# EAGLE design B152X (EAGLE 6.6.0)
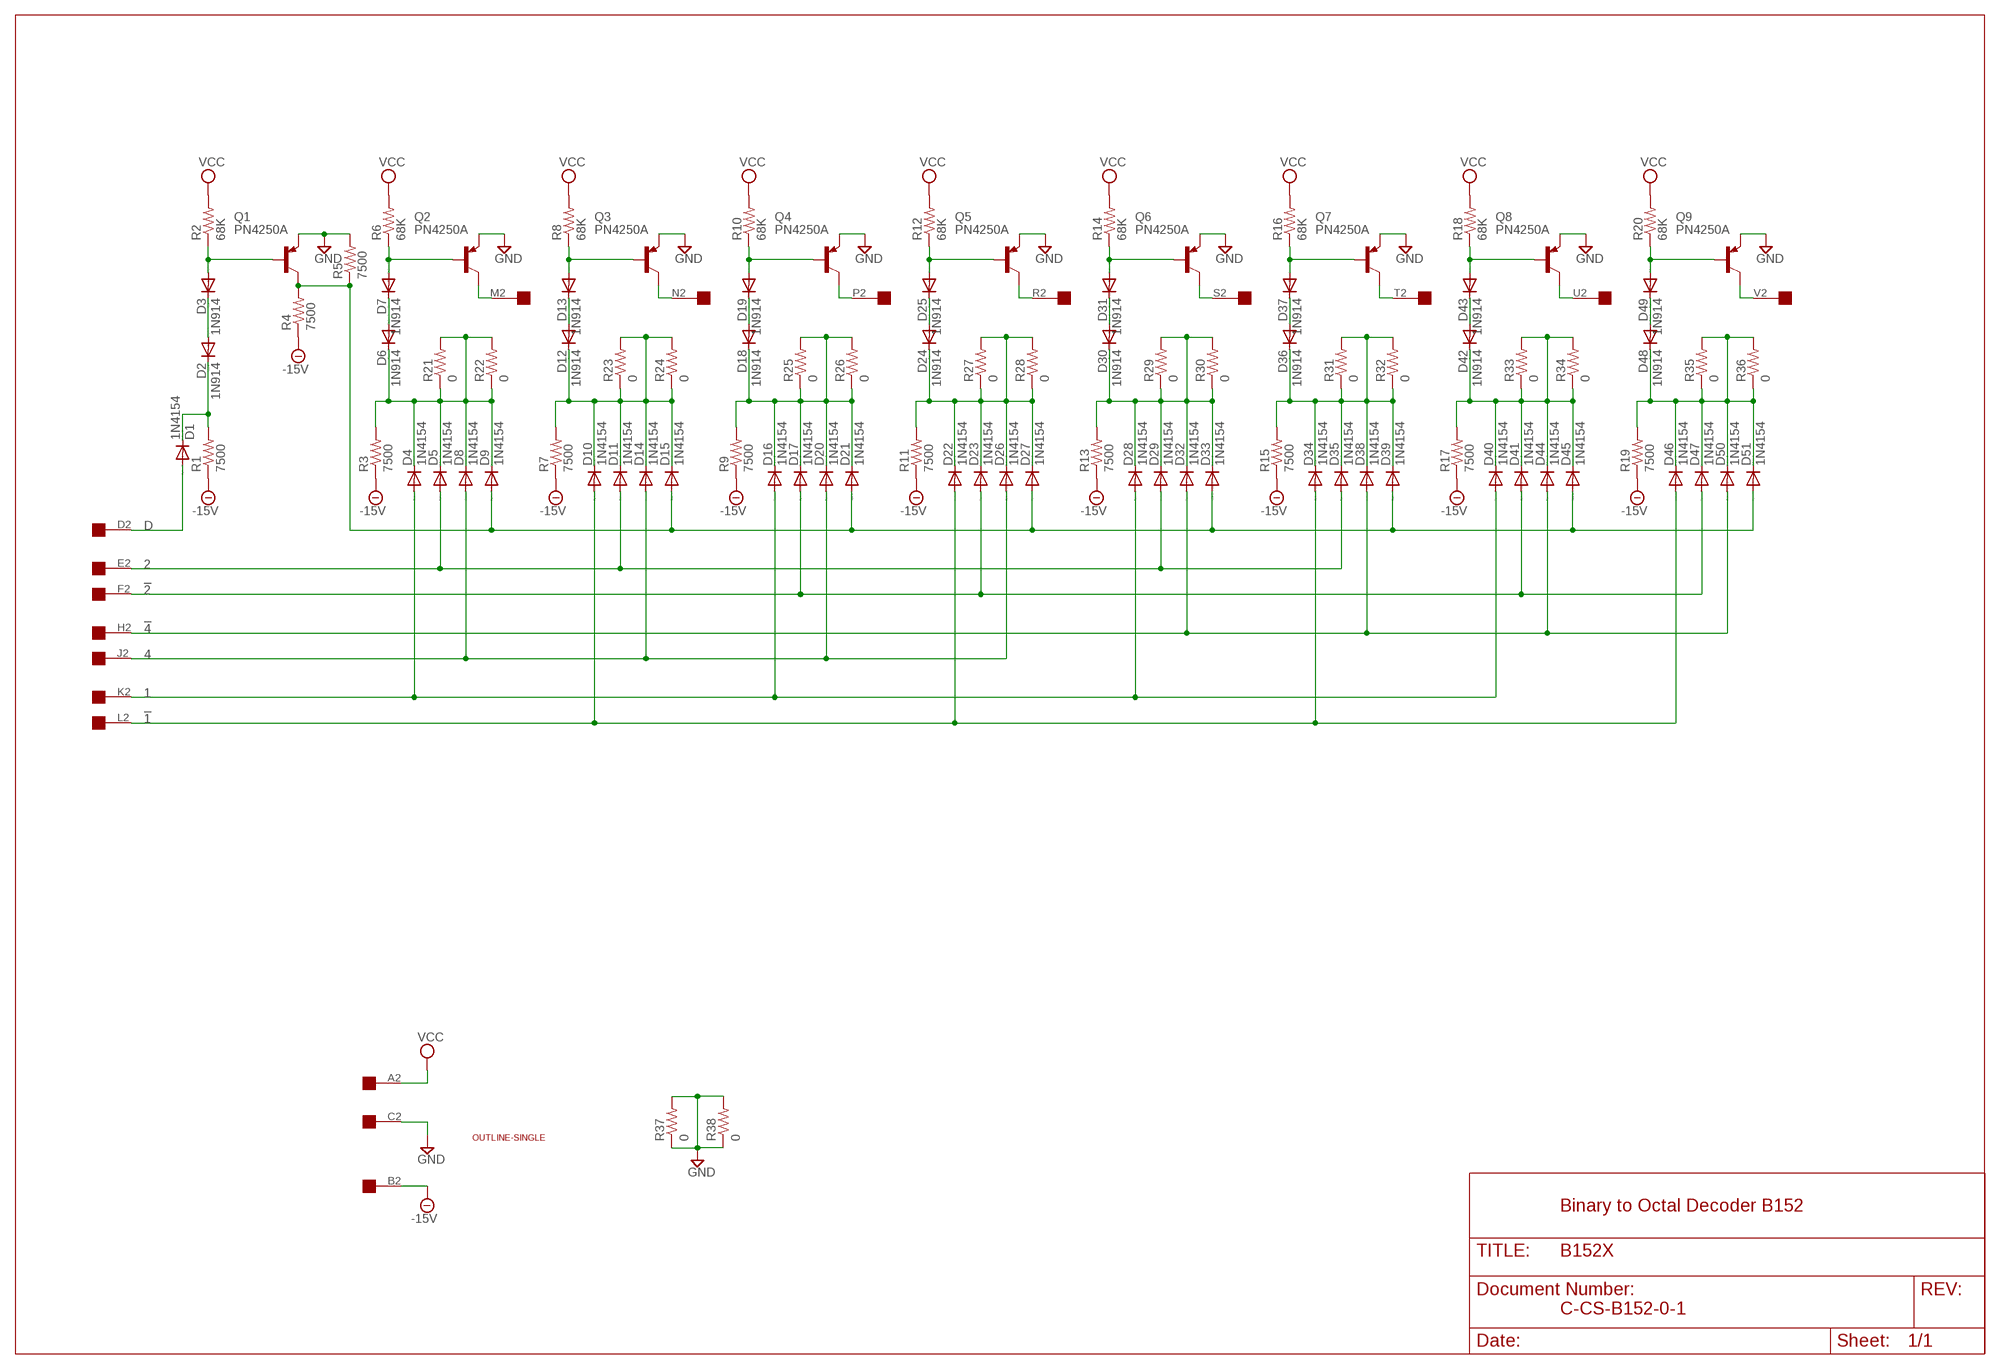
[diagram p0: schematic, sheet 1]

## Parts
D1  1N4154  DIODE-DO35-10  [DO35-10]
D2  1N914  DIODE-DO35-10  [DO35-10]
D3  1N914  DIODE-DO35-10  [DO35-10]
D4  1N4154  DIODE-DO35-10  [DO35-10]
D5  1N4154  DIODE-DO35-10  [DO35-10]
D6  1N914  DIODE-DO35-10  [DO35-10]
D7  1N914  DIODE-DO35-10  [DO35-10]
D8  1N4154  DIODE-DO35-10  [DO35-10]
D9  1N4154  DIODE-DO35-10  [DO35-10]
D10  1N4154  DIODE-DO35-10  [DO35-10]
D11  1N4154  DIODE-DO35-10  [DO35-10]
D12  1N914  DIODE-DO35-10  [DO35-10]
D13  1N914  DIODE-DO35-10  [DO35-10]
D14  1N4154  DIODE-DO35-10  [DO35-10]
D15  1N4154  DIODE-DO35-10  [DO35-10]
D16  1N4154  DIODE-DO35-10  [DO35-10]
D17  1N4154  DIODE-DO35-10  [DO35-10]
D18  1N914  DIODE-DO35-10  [DO35-10]
D19  1N914  DIODE-DO35-10  [DO35-10]
D20  1N4154  DIODE-DO35-10  [DO35-10]
D21  1N4154  DIODE-DO35-10  [DO35-10]
D22  1N4154  DIODE-DO35-10  [DO35-10]
D23  1N4154  DIODE-DO35-10  [DO35-10]
D24  1N914  DIODE-DO35-10  [DO35-10]
D25  1N914  DIODE-DO35-10  [DO35-10]
D26  1N4154  DIODE-DO35-10  [DO35-10]
D27  1N4154  DIODE-DO35-10  [DO35-10]
D28  1N4154  DIODE-DO35-10  [DO35-10]
D29  1N4154  DIODE-DO35-10  [DO35-10]
D30  1N914  DIODE-DO35-10  [DO35-10]
D31  1N914  DIODE-DO35-10  [DO35-10]
D32  1N4154  DIODE-DO35-10  [DO35-10]
D33  1N4154  DIODE-DO35-10  [DO35-10]
D34  1N4154  DIODE-DO35-10  [DO35-10]
D35  1N4154  DIODE-DO35-10  [DO35-10]
D36  1N914  DIODE-DO35-10  [DO35-10]
D37  1N914  DIODE-DO35-10  [DO35-10]
D38  1N4154  DIODE-DO35-10  [DO35-10]
D39  1N4154  DIODE-DO35-10  [DO35-10]
D40  1N4154  DIODE-DO35-10  [DO35-10]
D41  1N4154  DIODE-DO35-10  [DO35-10]
D42  1N914  DIODE-DO35-10  [DO35-10]
D43  1N914  DIODE-DO35-10  [DO35-10]
D44  1N4154  DIODE-DO35-10  [DO35-10]
D45  1N4154  DIODE-DO35-10  [DO35-10]
D46  1N4154  DIODE-DO35-10  [DO35-10]
D47  1N4154  DIODE-DO35-10  [DO35-10]
D48  1N914  DIODE-DO35-10  [DO35-10]
D49  1N914  DIODE-DO35-10  [DO35-10]
D50  1N4154  DIODE-DO35-10  [DO35-10]
D51  1N4154  DIODE-DO35-10  [DO35-10]
Q1  PN4250A  -PNP-TO5  [TO5]
Q2  PN4250A  -PNP-TO5  [TO5]
Q3  PN4250A  -PNP-TO5  [TO5]
Q4  PN4250A  -PNP-TO5  [TO5]
Q5  PN4250A  -PNP-TO5  [TO5]
Q6  PN4250A  -PNP-TO5  [TO5]
Q7  PN4250A  -PNP-TO5  [TO5]
Q8  PN4250A  -PNP-TO5  [TO5]
Q9  PN4250A  -PNP-TO5  [TO5]
R1  7500  R-US_0207/10  [0207/10]
R2  68K  R-US_0207/10  [0207/10]
R3  7500  R-US_0207/10  [0207/10]
R4  7500  R-US_0207/10  [0207/10]
R5  7500  R-US_0207/10  [0207/10]
R6  68K  R-US_0207/10  [0207/10]
R7  7500  R-US_0207/10  [0207/10]
R8  68K  R-US_0207/10  [0207/10]
R9  7500  R-US_0207/10  [0207/10]
R10  68K  R-US_0207/10  [0207/10]
R11  7500  R-US_0207/10  [0207/10]
R12  68K  R-US_0207/10  [0207/10]
R13  7500  R-US_0207/10  [0207/10]
R14  68K  R-US_0207/10  [0207/10]
R15  7500  R-US_0207/10  [0207/10]
R16  68K  R-US_0207/10  [0207/10]
R17  7500  R-US_0207/10  [0207/10]
R18  68K  R-US_0207/10  [0207/10]
R19  7500  R-US_0207/10  [0207/10]
R20  68K  R-US_0207/10  [0207/10]
R21  0  R-US_0207/10  [0207/10]
R22  0  R-US_0207/10  [0207/10]
R23  0  R-US_0207/10  [0207/10]
R24  0  R-US_0207/10  [0207/10]
R25  0  R-US_0207/10  [0207/10]
R26  0  R-US_0207/10  [0207/10]
R27  0  R-US_0207/10  [0207/10]
R28  0  R-US_0207/10  [0207/10]
R29  0  R-US_0207/10  [0207/10]
R30  0  R-US_0207/10  [0207/10]
R31  0  R-US_0207/10  [0207/10]
R32  0  R-US_0207/10  [0207/10]
R33  0  R-US_0207/10  [0207/10]
R34  0  R-US_0207/10  [0207/10]
R35  0  R-US_0207/10  [0207/10]
R36  0  R-US_0207/10  [0207/10]
R37  0  R-US_0207/10  [0207/10]
R38  0  R-US_0207/10  [0207/10]
U$1  OUTLINE-SINGLE  [SINGLE]
U$2  EDGE-1  [EDGE-CON1]

## Nets
1: D4.A D16.A D28.A D40.A U$2.K2
2: D5.A D11.A D29.A D35.A U$2.E2
4: D8.A D14.A D20.A D26.A U$2.J2
!1: D10.A D22.A D34.A D46.A U$2.L2
!2: D17.A D23.A D41.A D47.A U$2.F2
!4: D32.A D38.A D44.A D50.A U$2.H2
-15V: R1.1 R3.1 R4.1 R7.1 R9.1 R11.1 R13.1 R15.1 R17.1 R19.1 U$2.B2
D: D1.A U$2.D2
GND: Q1.1(E) Q2.1(E) Q3.1(E) Q4.1(E) Q5.1(E) Q6.1(E) Q7.1(E) Q8.1(E) Q9.1(E) R5.2 R37.1 R37.2 R38.1 R38.2 U$2.C2
N$1: D3.A Q1.2(B) R2.1
N$2: D2.A D3.C
N$3: D1.C D2.C R1.2
N$4: D9.A D15.A D21.A D27.A D33.A D39.A D45.A D51.A Q1.3(C) R4.2 R5.1
N$5: D28.C D29.C D30.C D32.C D33.C R13.2 R29.1 R29.2 R30.1 R30.2
N$6: D34.C D35.C D36.C D38.C D39.C R15.2 R31.1 R31.2 R32.1 R32.2
N$7: D40.C D41.C D42.C D44.C D45.C R17.2 R33.1 R33.2 R34.1 R34.2
N$8: D46.C D47.C D48.C D50.C D51.C R19.2 R35.1 R35.2 R36.1 R36.2
N$9: D4.C D5.C D6.C D8.C D9.C R3.2 R21.1 R21.2 R22.1 R22.2
N$10: D10.C D11.C D12.C D14.C D15.C R7.2 R23.1 R23.2 R24.1 R24.2
N$12: D6.A D7.C
N$13: D7.A Q2.2(B) R6.1
N$14: Q2.3(C) U$2.M2
N$15: D16.C D17.C D18.C D20.C D21.C R9.2 R25.1 R25.2 R26.1 R26.2
N$17: D12.A D13.C
N$18: D13.A Q3.2(B) R8.1
N$19: Q3.3(C) U$2.N2
N$20: D22.C D23.C D24.C D26.C D27.C R11.2 R27.1 R27.2 R28.1 R28.2
N$22: D18.A D19.C
N$23: D19.A Q4.2(B) R10.1
N$24: Q4.3(C) U$2.P2
N$27: D24.A D25.C
N$28: D25.A Q5.2(B) R12.1
N$29: Q5.3(C) U$2.R2
N$32: D30.A D31.C
N$33: D31.A Q6.2(B) R14.1
N$34: Q6.3(C) U$2.S2
N$37: D36.A D37.C
N$38: D37.A Q7.2(B) R16.1
N$39: Q7.3(C) U$2.T2
N$42: D42.A D43.C
N$43: D43.A Q8.2(B) R18.1
N$44: Q8.3(C) U$2.U2
N$47: D48.A D49.C
N$48: D49.A Q9.2(B) R20.1
N$49: Q9.3(C) U$2.V2
VCC: R2.2 R6.2 R8.2 R10.2 R12.2 R14.2 R16.2 R18.2 R20.2 U$2.A2

## Notes on the sheet
- Binary to Octal Decoder B152
- C-CS-B152-0-1

## Library data of the parts
D1-D51 = diode:DIODE-: DIODE
Q1-Q9 = transistor:*-PNP-: PNP Transistror
R1-R38 = rcl:R-US_: RESISTOR, American symbol
U$1 = dec-con:OUTLINE-*: Board outlines for DEC boards.
U$2 = dec-con:EDGE-1: Single-Sided DEC Edge Connector -- (side 2)

## Board
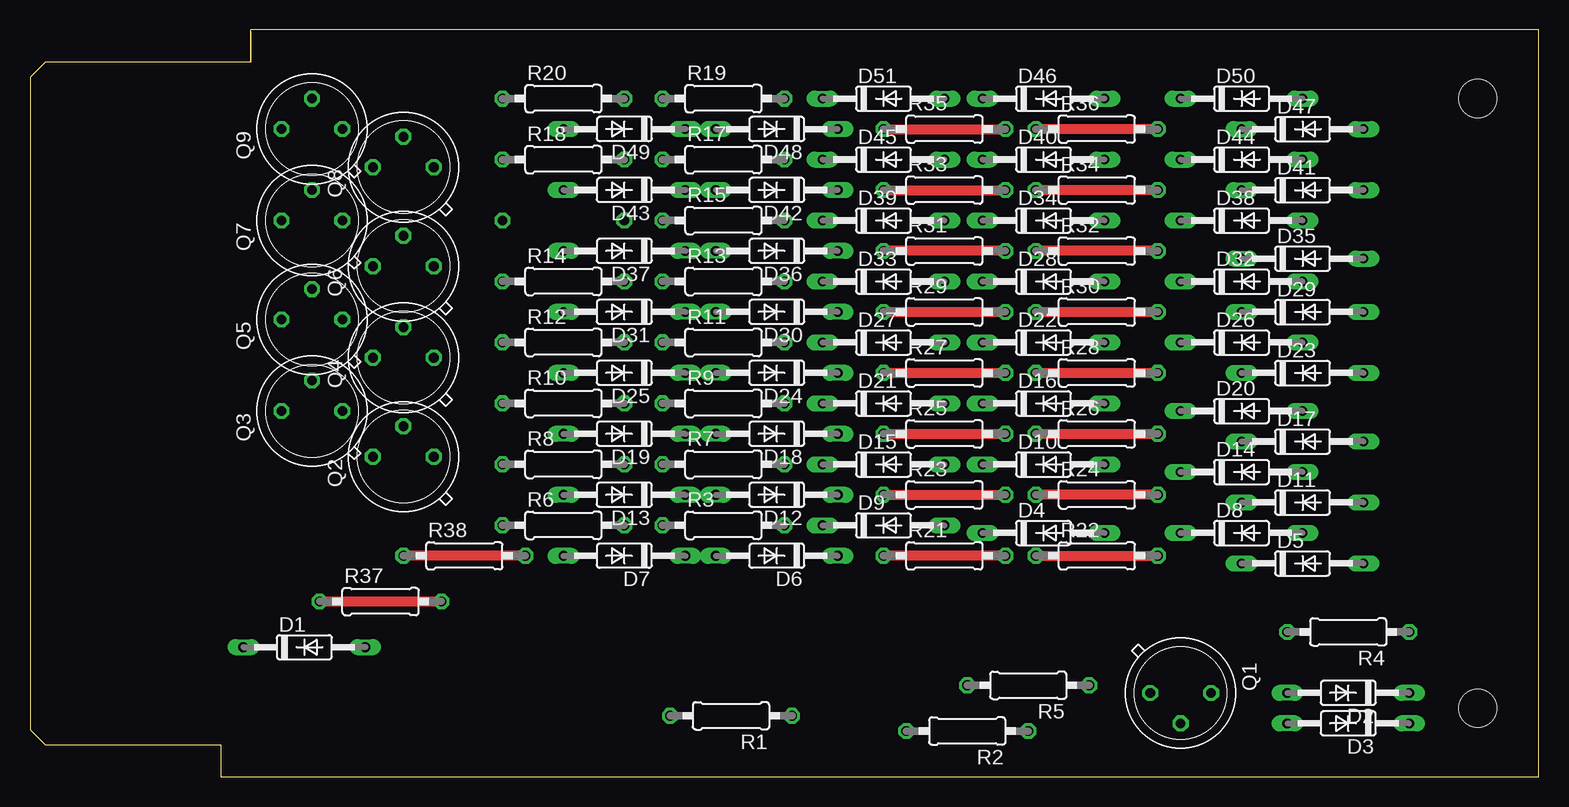
[diagram p1: board, top side]
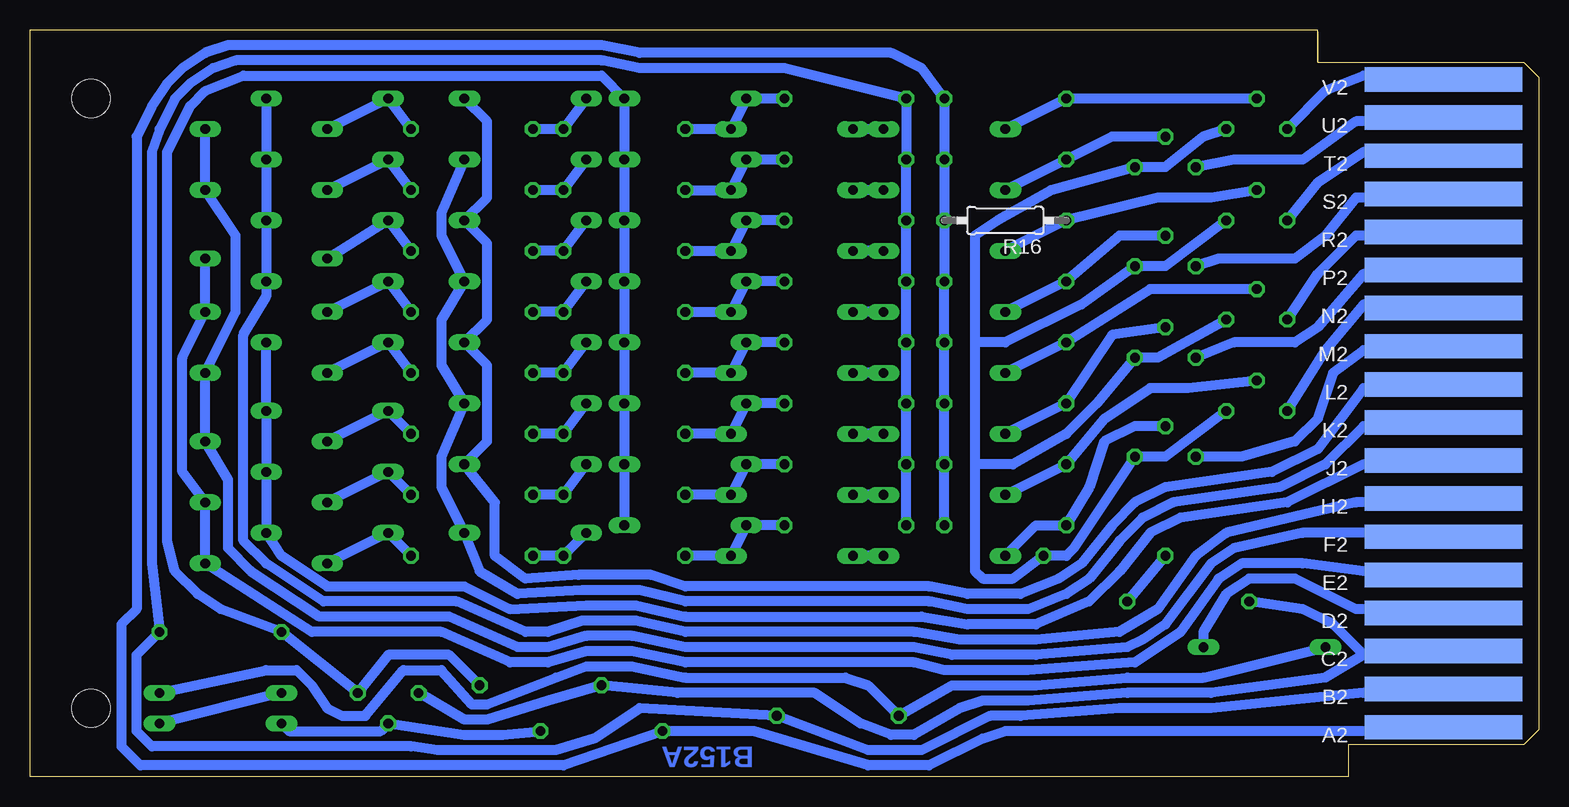
[diagram p2: board, bottom side, seen from below]

Size 125.73 x 62.23 mm. Coordinates in mm from the lower left corner, seen from the top.
Copper layers (1+16): Top 0.035mm / dielectric 1.5mm / Bottom 0.035mm
Design rules "16mils": minimum track width 16mil, minimum drill 32mil, track to track 15mil, track to pad 10mil, pad to pad 10mil, via to via 10mil, smd to smd 10mil, copper to edge 13mil, drill to drill 10mil, minimum pad ring 10mil, minimum via ring 8mil, stop-mask expansion 0mil, vias tented up to drill 0mil, thermal gap 10mil

### Footprints (pad centres in the part's own frame; a part is rotated, then mirrored left to right if it is on the bottom)
DO35-10 = drill 0.813 long: A 5.08,0; C -5.08,0
TO5 = drill 0.813 octagon: 1 0,-2.54; 2 2.54,0; 3 0,2.54
0207/10 = drill 0.813 octagon: 1 -5.08,0; 2 5.08,0
SINGLE = hole 3.175: 120.65,56.515; 120.65,5.715
EDGE-CON1 = smd 13.106 x 2.032 bottom: A2 7.938,4.128; B2 7.938,7.303; C2 7.938,10.477; D2 7.938,13.652; E2 7.938,16.828; F2 7.938,20.003; H2 7.938,23.177; J2 7.938,26.352; K2 7.938,29.527; L2 7.938,32.703; M2 7.938,35.877; N2 7.938,39.053; P2 7.938,42.227; R2 7.938,45.403; S2 7.938,48.578; T2 7.938,51.752; U2 7.938,54.928; V2 7.938,58.102

### Placement (x,y rotation side)
D1  22.86,10.79 0 top
D2  109.86,6.99 180 top
D3  109.86,4.45 180 top
D4  84.46,20.32 0 top
D5  106.05,17.78 0 top
D6  62.23,18.41 180 top
D7  49.53,18.41 180 top
D8  100.97,20.32 0 top
D9  71.12,20.95 0 top
D10  84.46,26.04 0 top
D11  106.05,22.86 0 top
D12  62.23,23.5 180 top
D13  49.53,23.5 180 top
D14  100.97,25.4 0 top
D15  71.12,26.04 0 top
D16  84.46,31.11 0 top
D17  106.05,27.94 0 top
D18  62.23,28.57 180 top
D19  49.53,28.57 180 top
D20  100.97,30.48 0 top
D21  71.12,31.11 0 top
D22  84.46,36.2 0 top
D23  106.05,33.66 0 top
D24  62.23,33.66 180 top
D25  49.53,33.66 180 top
D26  100.97,36.2 0 top
D27  71.12,36.2 0 top
D28  84.46,41.27 0 top
D29  106.05,38.73 0 top
D30  62.23,38.73 180 top
D31  49.53,38.73 180 top
D32  100.97,41.27 0 top
D33  71.12,41.27 0 top
D34  84.46,46.35 0 top
D35  106.05,43.18 0 top
D36  62.23,43.81 180 top
D37  49.53,43.81 180 top
D38  100.97,46.35 0 top
D39  71.12,46.35 0 top
D40  84.46,51.44 0 top
D41  106.05,48.9 0 top
D42  62.23,48.9 180 top
D43  49.53,48.9 180 top
D44  100.97,51.44 0 top
D45  71.12,51.44 0 top
D46  84.46,56.52 0 top
D47  106.05,53.98 0 top
D48  62.23,53.98 180 top
D49  49.53,53.98 180 top
D50  100.97,56.52 0 top
D51  71.12,56.52 0 top
Q1  95.89,6.99 270 top
Q2  31.12,26.67 90 top
Q3  23.5,30.48 90 top
Q4  31.12,34.92 90 top
Q5  23.5,38.1 90 top
Q6  31.12,42.55 90 top
Q7  23.5,46.35 90 top
Q8  31.12,50.8 90 top
Q9  23.5,53.98 90 top
R1  58.42,5.08 180 top
R2  78.11,3.81 180 top
R3  57.79,20.95 0 top
R4  109.86,12.06 180 top
R5  83.19,7.62 180 top
R6  44.45,20.95 0 top
R7  57.79,26.04 0 top
R8  44.45,26.04 0 top
R9  57.79,31.11 0 top
R10  44.45,31.11 0 top
R11  57.79,36.2 0 top
R12  44.45,36.2 0 top
R13  57.79,41.27 0 top
R14  44.45,41.27 0 top
R15  57.79,46.35 0 top
R16  44.45,46.35 180 bottom
R17  57.79,51.44 0 top
R18  44.45,51.44 0 top
R19  57.79,56.52 0 top
R20  44.45,56.52 0 top
R21  76.2,18.41 0 top
R22  88.9,18.41 0 top
R23  76.2,23.5 0 top
R24  88.9,23.5 0 top
R25  76.2,28.57 0 top
R26  88.9,28.57 0 top
R27  76.2,33.66 0 top
R28  88.9,33.66 0 top
R29  76.2,38.73 0 top
R30  88.9,38.73 0 top
R31  76.2,43.81 0 top
R32  88.9,43.81 0 top
R33  76.2,48.9 0 top
R34  88.9,48.9 0 top
R35  76.2,53.98 0 top
R36  88.9,53.98 0 top
R37  29.21,14.61 0 top
R38  36.2,18.41 0 top
U$1  0,0 0 top
U$2  0,0 0 top

### Tracks (layer width: path | path; a pad name or v marks a point on that pad's centre or on a via)
1
  Bottom 0.813: U$2.K2 8.89,29.21 14.61,29.21 17.78,26.04 21.59,24.13 30.48,22.86 33.02,21.59 34.93,19.68 37.47,16.51 39.37,15.24 42.55,13.97 47.63,13.97 50.8,14.61 71.12,14.61 74.93,15.56 79.69,15.56 85.09,15.24 88.27,17.14 D4.A 91.44,24.13 91.44,26.67 D16.A 91.44,34.29 91.44,38.1 D28.A 91.44,45.09 91.44,46.99 D40.A
2
  Bottom 0.813: U$2.E2 8.89,17.14 14.61,17.14 19.69,17.78 24.77,17.78 26.67,16.51 29.85,12.06 33.66,9.53 42.55,8.89 49.53,8.89 52.07,9.53 71.12,9.53 75.57,10.48 79.38,10.48 82.55,9.53 85.73,9.53 91.44,12.06 102.24,12.06 D5.A D11.A 113.03,25.4 113.03,34.92 D29.A D35.A
4
  Bottom 0.813: U$2.J2 8.89,26.04 14.61,26.04 20.96,22.86 29.85,21.59 32.39,20.32 34.93,17.14 37.47,14.61 41.91,12.7 47.63,12.7 51.44,13.34 71.12,13.34 75.25,14.29 79.38,14.29 85.73,13.97 89.54,15.88 100.97,15.88 104.78,18.41 D8.A D14.A D20.A D26.A
!1
  Bottom 0.813: U$2.L2 8.89,32.38 14.61,32.38 18.42,27.3 22.23,25.4 31.12,24.13 33.66,22.86 35.56,20.95 38.1,17.78 40.01,16.51 43.18,15.24 47.63,15.24 50.8,15.88 71.12,15.88 73.98,16.83 80.01,16.83 84.46,16.51 87,18.41 87,22.86 D10.A 87.63,27.94 87.63,34.29 D22.A 87.63,38.1 87.63,44.45 D34.A 87.63,48.26 87.63,54.61 D46.A
!2
  Bottom 0.813: U$2.F2 8.89,20.32 19.69,20.32 25.4,19.05 27.31,17.78 31.12,12.7 33.02,11.43 34.29,10.79 41.91,10.16 48.9,10.16 52.07,10.79 71.12,10.79 75.57,11.75 79.38,11.75 82.55,10.79 85.09,10.79 90.81,13.34 101.6,13.34 107.32,17.14 109.22,19.05 109.22,24.77 D17.A D23.A 108.59,38.73 108.59,45.09 D41.A D47.A
!4
  Bottom 0.813: U$2.H2 8.89,22.86 15.24,22.86 26.04,20.32 28.58,18.41 31.75,13.97 34.93,12.06 41.91,11.43 48.26,11.43 52.07,12.06 71.12,12.06 75.25,13.02 79.69,13.02 82.55,12.06 84.46,12.06 90.17,14.61 101.28,14.61 106.05,17.78 107.95,19.68 107.95,36.83 106.05,40.01 D32.A D38.A D44.A D50.A
-15V
  Bottom 0.813: U$2.B2 9.53,6.99 14.61,6.99 27.31,5.71 34.93,5.71 43.18,5.08 45.72,5.08 51.44,2.22 55.88,2.22 R1.1 74.93,5.71 78.74,3.17 81.92,2.22 91.76,2.22 93.98,2.54 115.57,2.54 116.84,3.81 116.84,10.16 R4.1 115.57,17.78 115.57,52.07 114.94,53.98 113.67,56.52 112.4,57.78 110.49,59.05 108.59,59.69 78.11,59.69 74.93,59.05 62.87,59.05 R19.1 R17.1 R15.1 R13.1 R11.1 R9.1 R7.1 R3.1
D
  Bottom 0.813: U$2.D2 8.89,13.97 15.24,13.97 20.32,16.51 24.13,16.51 26.04,15.24 27.94,12.06 D1.A
GND
  Top 0.813: R37.1 R37.2 | R38.2 R38.1
  Bottom 0.813: U$2.C2 8.26,10.48 8.26,10.16 14.61,10.16 | 14.61,10.16 17.78,8.26 27.31,6.99 34.29,6.99 42.55,6.35 46.36,6.35 48.26,5.71 52.07,3.49 53.98,3.49 56.52,4.45 60.33,6.99 71.76,6.99 R5.2 82.55,6.35 87.63,4.76 89.54,4.76 Q1.1 | 14.61,10.16 17.15,12.7 19.69,13.97 R37.1 | R38.1 R37.2 | 46.99,26.04 43.82,26.04 39.37,28.57 36.83,31.11 Q4.1 31.75,34.92 Q5.1 | 46.99,26.04 46.99,17.14 46.36,16.51 43.82,16.51 R38.2 39.37,18.41 38.74,19.05 Q2.1 31.12,26.67 Q3.1 | 46.99,36.2 44.45,36.2 38.1,39.37 Q6.1 31.12,42.55 Q7.1 | 46.99,36.2 46.99,26.04 | Q9.1 27.94,53.34 31.12,50.8 Q8.1 40.64,48.9 45.09,46.35 46.99,45.09 46.99,36.2
N$1
  Bottom 0.813: D3.A 104.14,3.81 96.52,3.81 Q1.2 89.54,3.49 86.36,3.49 R2.1
N$2
  Bottom 0.813: D2.A D3.C
N$3
  Bottom 0.813: D2.C 106.05,8.89 103.51,8.89 102.24,7.62 100.97,5.71 99.7,5.08 97.79,5.08 94.62,8.89 91.44,8.89 88.9,6.03 87.63,6.03 81.92,8.26 79.38,9.21 75.57,9.21 71.12,8.26 57.79,8.26 55.88,7.62 R1.2 48.9,7.62 41.91,7.62 34.29,8.26 27.94,8.26 D1.C
N$4
  Bottom 0.813: D9.A D15.A D21.A D27.A D33.A D39.A D45.A D51.A 78.11,58.42 107.95,58.42 111.13,57.15 112.4,55.88 114.3,52.07 114.3,19.68 113.67,17.14 111.76,15.24 109.86,13.97 R4.2 Q1.3 95.89,10.16 90.81,10.16 R5.1
N$5
  Top 0.813: R29.1 R29.2 | R30.1 R30.2
  Bottom 0.813: R30.1 R29.2 D28.C | R13.2 D33.C D30.C R29.1 | R30.2 D32.C D29.C
N$6
  Top 0.813: R32.2 R32.1 | R31.2 R31.1
  Bottom 0.813: R32.1 R31.2 D34.C | R15.2 D39.C D36.C R31.1 | R32.2 D38.C D35.C
N$7
  Top 0.813: R33.1 R33.2 | R34.2 R34.1
  Bottom 0.813: R34.1 R33.2 D40.C | R34.2 D44.C D41.C | R17.2 D45.C D42.C R33.1
N$8
  Top 0.813: R35.1 R35.2 | R36.2 R36.1
  Bottom 0.813: R36.1 R35.2 D46.C | R36.2 D50.C D47.C | R19.2 D51.C D48.C R35.1
N$9
  Top 0.813: R21.2 R21.1 | R22.1 R22.2
  Bottom 0.813: R22.1 R21.2 D4.C | R22.2 D8.C D5.C | R21.1 D6.C D9.C R3.2
N$10
  Top 0.813: R24.2 R24.1 | R23.1 R23.2
  Bottom 0.813: R24.1 R23.2 D10.C | R24.2 D14.C D11.C | R23.1 D12.C D15.C R7.2
N$12
  Bottom 0.813: D7.C D6.A
N$13
  Bottom 0.813: Q2.2 33.66,29.21 36.2,27.94 37.47,24.13 R6.1 41.91,20.95 D7.A
N$14
  Bottom 0.813: U$2.M2 8.89,35.56 14.61,35.56 17.15,33.66 18.42,29.84 20.32,27.94 24.77,26.67 Q2.3
N$15
  Top 0.813: R25.1 R25.2 | R26.1 R26.2
  Bottom 0.813: R26.1 R25.2 D16.C | R26.2 D20.C D17.C | R25.1 D18.C D21.C R9.2
N$17
  Bottom 0.813: D13.C D12.A
N$18
  Bottom 0.813: Q3.2 29.21,32.38 32.39,32.38 36.2,29.84 R8.1 D13.A
N$19
  Bottom 0.813: U$2.N2 8.89,39.37 14.61,39.37 17.78,35.56 Q3.3
N$20
  Top 0.813: R27.1 R27.2 | R28.1 R28.2
  Bottom 0.813: R28.1 R27.2 D22.C | R28.2 D26.C D23.C | R27.1 D24.C D27.C R11.2
N$22
  Bottom 0.813: D19.C D18.A
N$23
  Bottom 0.813: Q4.2 35.56,36.83 R10.1 D19.A
N$24
  Bottom 0.813: U$2.P2 8.89,41.91 14.61,41.91 18.42,37.47 20.32,36.2 25.4,36.2 Q4.3
N$27
  Bottom 0.813: D25.C D24.A
N$28
  Bottom 0.813: Q5.2 32.39,40.64 R12.1 D25.A
N$29
  Bottom 0.813: U$2.R2 8.26,45.09 15.24,45.09 18.42,41.91 Q5.3
N$32
  Bottom 0.813: D31.C D30.A
N$33
  Bottom 0.813: Q6.2 34.93,45.09 R14.1 D31.A
N$34
  Bottom 0.813: U$2.S2 8.89,48.26 15.24,48.26 17.78,45.09 20.32,43.18 26.67,43.18 Q6.3
N$37
  Bottom 0.813: D37.C D36.A
N$38
  Bottom 0.813: Q7.2 27.31,48.26 31.75,48.26 R16.1 D37.A
N$39
  Bottom 0.813: U$2.T2 8.89,52.07 14.61,52.07 18.42,49.53 Q7.3
N$42
  Bottom 0.813: D43.C D42.A
N$43
  Bottom 0.813: Q8.2 35.56,53.34 R18.1 D43.A
N$44
  Bottom 0.813: U$2.U2 8.89,54.61 15.24,54.61 19.69,51.44 25.4,51.44 Q8.3
N$47
  Bottom 0.813: D49.C D48.A
N$48
  Bottom 0.813: Q9.2 R20.1 D49.A
N$49
  Bottom 0.813: U$2.V2 8.89,58.42 14.61,58.42 17.78,57.15 Q9.3
VCC
  Bottom 0.813: U$2.A2 8.89,3.81 44.45,3.81 46.36,3.17 50.8,0.95 55.88,0.95 65.41,3.81 R2.2 81.28,0.95 116.52,0.95 118.11,2.54 118.11,12.7 116.84,13.97 116.84,53.34 115.57,55.88 114.3,57.78 113.03,59.05 111.13,60.33 109.22,60.96 78.11,60.96 74.93,60.33 53.98,60.33 51.44,59.05 R20.2 R18.2 R16.2 R14.2 R12.2 R10.2 R8.2 R6.2

### Text on the board
Bottom: B152A